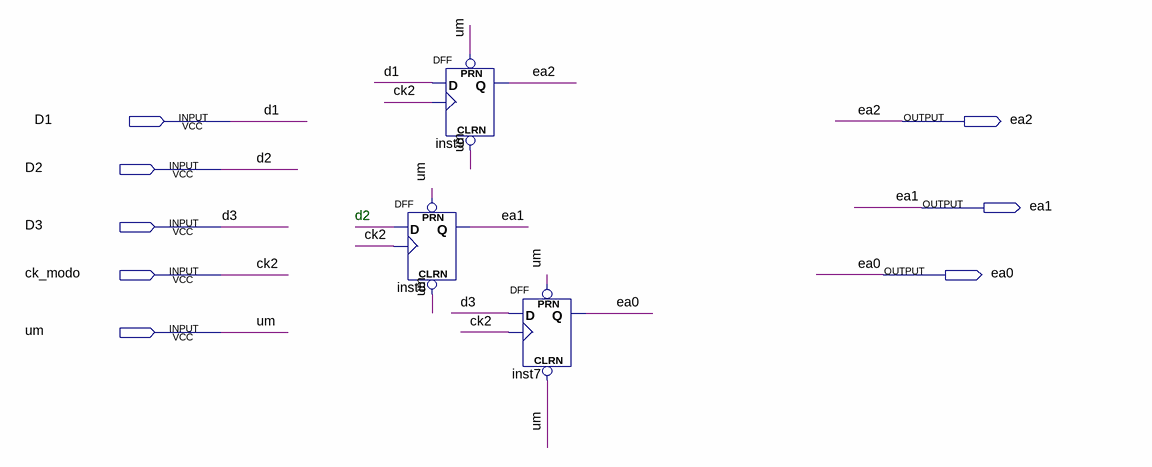
[diagram p0: schematic sheet]
// Quartus schematic registrador_maq_estados.bdf as structural Verilog: 3 symbols, 8 pins
module registrador_maq_estados (
  input  D1,
  input  D2,
  input  D3,
  input  ck_modo,
  input  um,
  output ea2,
  output ea1,
  output ea0
);

  DFF inst8 (.CLRN(um), .CLK(ck_modo), .D(D2), .PRN(um), .Q(ea1));
  DFF inst9 (.CLRN(um), .CLK(ck_modo), .D(D1), .PRN(um), .Q(ea2));
  DFF inst7 (.CLRN(um), .CLK(ck_modo), .D(D3), .PRN(um), .Q(ea0));

  // Other names for the same wires on the sheet: ck2 = ck_modo

  // Notes on the sheet:
  //   d2
endmodule
